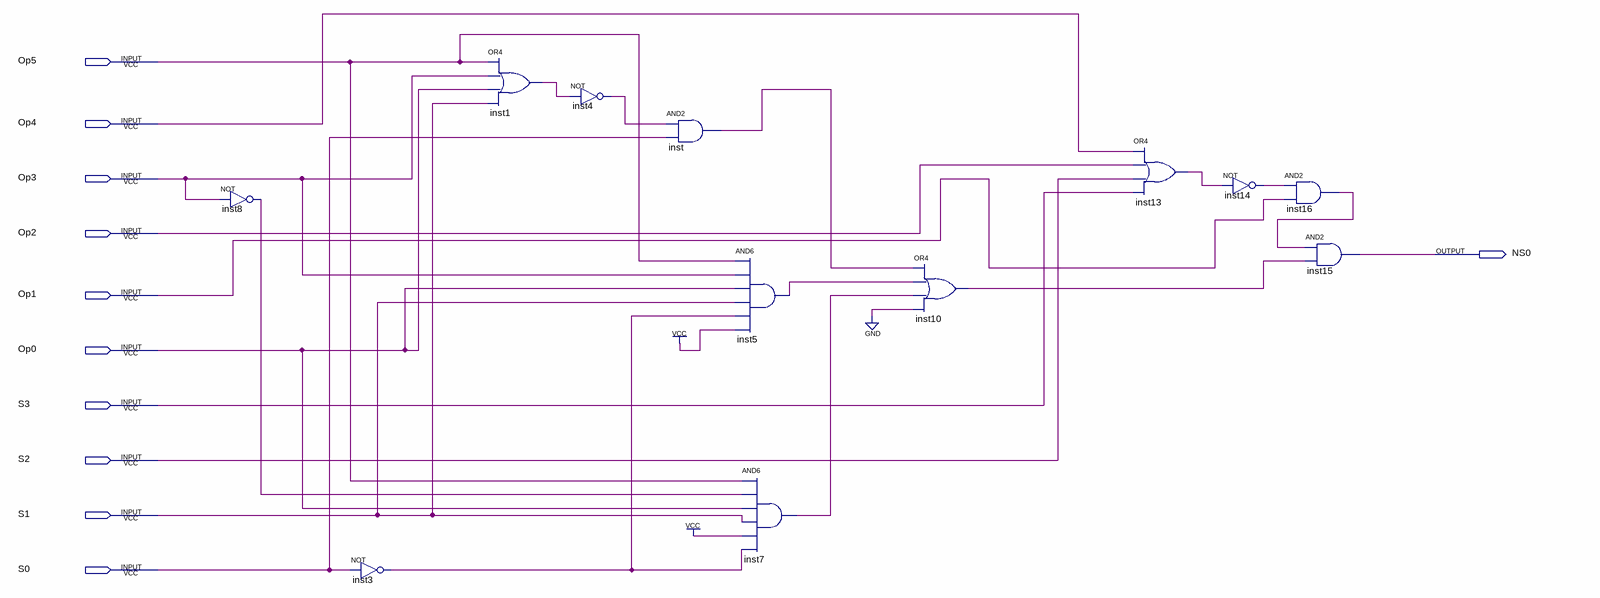
[diagram p0: schematic sheet]
// Quartus schematic NS0.bdf as structural Verilog: 12 symbols, 11 pins
module NS0 (
  input  Op5,
  input  Op4,
  input  Op3,
  input  Op2,
  input  Op1,
  input  Op0,
  input  S3,
  input  S2,
  input  S1,
  input  S0,
  output NS0
);

  wire inst1_out, inst3_out, inst4_out, inst5_out, inst7_out, inst8_out, inst10_out, inst13_out, inst14_out,
       inst16_out, inst_out;

  not inst8 (inst8_out, Op3);
  not inst3 (inst3_out, S0);
  or inst1 (inst1_out, Op5, Op3, Op0, S1);
  not inst4 (inst4_out, inst1_out);
  and inst (inst_out, inst4_out, S0);
  and inst5 (inst5_out, Op5, Op3, Op0, S1, inst3_out, 1'b1);
  and inst7 (inst7_out, Op5, inst8_out, Op0, S1, 1'b1, inst3_out);
  or inst10 (inst10_out, inst_out, inst5_out, inst7_out, 1'b0);
  or inst13 (inst13_out, Op4, Op2, S2, S3);
  not inst14 (inst14_out, inst13_out);
  and inst16 (inst16_out, inst14_out, Op1);
  and inst15 (NS0, inst16_out, inst10_out);
endmodule
